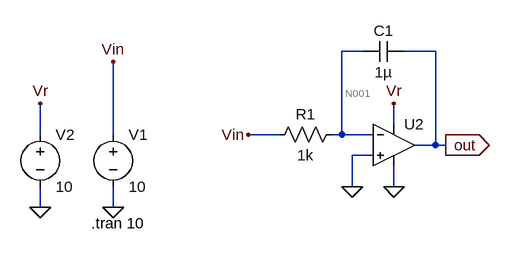
[diagram p0: schematic opamp_1.asc]
opamp_1.asc, the LTspice schematic file:
Version 4
SHEET 1 880 680
WIRE 144 32 112 32
WIRE 256 32 208 32
WIRE 192 144 192 112
WIRE -352 160 -352 112
WIRE -240 160 -240 48
WIRE 16 160 -32 160
WIRE 112 160 112 32
WIRE 112 160 96 160
WIRE 160 160 112 160
WIRE 256 176 256 32
WIRE 256 176 224 176
WIRE 272 176 256 176
WIRE 160 192 128 192
WIRE 128 240 128 192
WIRE 192 240 192 208
WIRE -352 272 -352 240
WIRE -240 272 -240 240
FLAG 128 240 0
FLAG 272 176 out
IOPIN 272 176 Out
FLAG -32 160 Vin
FLAG -240 48 Vin
FLAG -240 272 0
FLAG 192 240 0
FLAG -352 112 Vr
FLAG 192 112 Vr
FLAG -352 272 0
SYMBOL cap 208 16 R90
WINDOW 0 0 32 VBottom 2
WINDOW 3 32 32 VTop 2
SYMATTR InstName C1
SYMATTR Value 1µ
SYMBOL res 112 144 R90
WINDOW 0 0 56 VBottom 2
WINDOW 3 32 56 VTop 2
SYMATTR InstName R1
SYMATTR Value 1k
SYMBOL voltage -240 144 R0
WINDOW 123 0 0 Left 0
WINDOW 39 0 0 Left 0
SYMATTR InstName V1
SYMATTR Value 10
SYMBOL OpAmps\\UniversalOpAmp 192 176 R0
SYMATTR InstName U2
SYMBOL voltage -352 144 R0
WINDOW 123 0 0 Left 0
WINDOW 39 0 0 Left 0
SYMATTR InstName V2
SYMATTR Value 10
TEXT -274 296 Left 2 !.tran 10

The netlist it stands for:
* opamp_1.asc
C1 out N001 1µ
R1 N001 Vin 1k
V1 Vin 0 10
XU2 0 N001 Vr 0 out level1 Avol=1Meg GBW=10Meg Vos=0 En=0 Enk=0 In=0 Ink=0 Rin=500Meg  ; pins In+ In- V+ V- OUT
V2 Vr 0 10
.tran 10
.lib UniversalOpAmp1.lib
.backanno
.end

* Results of the author's LTspice run, read from the files saved beside the schematic
* Operating Point, zero values left out:
*   V(out) = -10 MV
*   V(n001) = 10 V
*   V(vin) = 10 V
*   V(vr) = 10 V
*   I(C1) = -10 pA
*   I(R1) = -20.01 nA
*   I(V1) = -20.01 nA
*   Ix(u2:2) = 20 nA
*   Ix(u2:3) = -10 nA
*   Ix(u2:4) = -10 nA